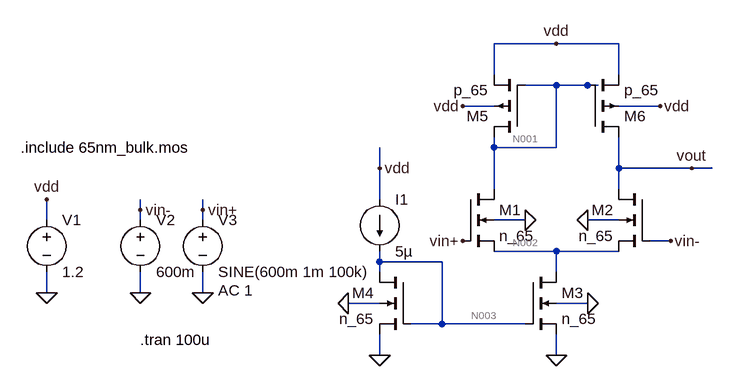
[diagram p0: schematic active_load_diff_amp.asc]
active_load_diff_amp.asc, the LTspice schematic file:
Version 4.1
SHEET 1 1004 680
WIRE 752 -32 656 -32
WIRE 848 -32 752 -32
WIRE 656 16 656 -32
WIRE 848 16 848 -32
WIRE 752 32 704 32
WIRE 800 32 752 32
WIRE 816 32 800 32
WIRE 656 64 608 64
WIRE 912 64 848 64
WIRE 656 128 656 112
WIRE 752 128 752 32
WIRE 752 128 656 128
WIRE 480 160 480 128
WIRE 848 160 848 112
WIRE 960 160 848 160
WIRE 992 160 960 160
WIRE 656 192 656 128
WIRE 848 192 848 160
WIRE 480 208 480 160
WIRE 112 224 112 208
WIRE 208 224 208 208
WIRE -32 240 -32 208
WIRE 112 240 112 224
WIRE 208 240 208 224
WIRE 704 240 656 240
WIRE 848 240 800 240
WIRE 928 272 896 272
WIRE 752 288 656 288
WIRE 848 288 752 288
WIRE 480 304 480 288
WIRE 576 304 480 304
WIRE 480 320 480 304
WIRE 752 320 752 288
WIRE -32 352 -32 320
WIRE 112 352 112 320
WIRE 208 352 208 320
WIRE 480 368 432 368
WIRE 800 368 752 368
WIRE 576 400 576 304
WIRE 576 400 528 400
WIRE 704 400 576 400
WIRE 480 448 480 416
WIRE 752 448 752 416
FLAG 704 240 0
FLAG 800 240 0
FLAG 800 368 0
FLAG 752 448 0
FLAG 432 368 0
FLAG 480 448 0
FLAG -32 352 0
FLAG -32 208 vdd
FLAG 480 160 vdd
FLAG 912 64 vdd
FLAG 608 64 vdd
FLAG 752 -32 vdd
FLAG 608 272 vin+
FLAG 960 160 vout
FLAG 112 352 0
FLAG 208 352 0
FLAG 112 224 vin-
FLAG 208 224 vin+
FLAG 928 272 vin-
SYMBOL nmos4 608 192 R0
SYMATTR InstName M1
SYMATTR Value n_65
SYMATTR Value2 l=200n w=20u
SYMBOL nmos4 896 192 M0
SYMATTR InstName M2
SYMATTR Value n_65
SYMATTR Value2 l=200n w=20u
SYMBOL nmos4 704 320 R0
SYMATTR InstName M3
SYMATTR Value n_65
SYMATTR Value2 l=500n w=30u
SYMBOL nmos4 528 320 M0
SYMATTR InstName M4
SYMATTR Value n_65
SYMATTR Value2 l=500n w=30u
SYMBOL current 480 208 R0
WINDOW 123 0 0 Left 0
WINDOW 39 0 0 Left 0
SYMATTR InstName I1
SYMATTR Value 5µ
SYMBOL voltage -32 224 R0
WINDOW 123 0 0 Left 0
WINDOW 39 0 0 Left 0
SYMATTR InstName V1
SYMATTR Value 1.2
SYMBOL pmos4 704 112 R180
SYMATTR InstName M5
SYMATTR Value p_65
SYMATTR Value2 l=300n w=10u
SYMBOL pmos4 800 112 M180
SYMATTR InstName M6
SYMATTR Value p_65
SYMATTR Value2 l=300n w=10u
SYMBOL voltage 112 224 R0
WINDOW 123 0 0 Left 0
WINDOW 39 0 0 Left 0
SYMATTR InstName V2
SYMATTR Value 600m
SYMBOL voltage 208 224 R0
WINDOW 123 24 124 Left 2
WINDOW 39 0 0 Left 0
SYMATTR Value2 AC 1
SYMATTR InstName V3
SYMATTR Value SINE(600m 1m 100k)
TEXT -72 128 Left 2 !.include 65nm_bulk.mos
TEXT 112 424 Left 2 !.tran 100u

The netlist it stands for:
* active_load_diff_amp.asc
M1 N001 vin+ N002 0 n_65 l=200n w=20u
M2 vout vin- N002 0 n_65 l=200n w=20u
M3 N002 N003 0 0 n_65 l=500n w=30u
M4 N003 N003 0 0 n_65 l=500n w=30u
I1 vdd N003 5µ
V1 vdd 0 1.2
M5 N001 N001 vdd vdd p_65 l=300n w=10u
M6 vout N001 vdd vdd p_65 l=300n w=10u
V2 vin- 0 600m
V3 vin+ 0 SINE(600m 1m 100k) AC 1
.model NMOS NMOS
.model PMOS PMOS
.lib standard.mos
.include 65nm_bulk.mos
.tran 100u
.backanno
.end

* Results of the author's LTspice run, read from the files saved beside the schematic
* Operating Point, zero values left out:
*   V(vin+) = 600 mV
*   V(vout) = 848.3 mV
*   V(vin-) = 600 mV
*   V(vdd) = 1.2 V
*   V(n001) = 848.3 mV
*   V(n002) = 297.8 mV
*   V(n003) = 296.1 mV
*   Id(M1) = 2.5 µA
*   Ig(M1) = 139.7 pA
*   Is(M1) = -2.5 µA
*   Ib(M1) = -1.16 pA
*   I(I1) = 5 µA
*   I(V1) = -9.999 µA
*   Id(M6) = -2.5 µA
*   Ig(M6) = -3.868 pA
*   Is(M6) = 2.5 µA
*   Id(M3) = 5 µA
*   Ig(M3) = 432.7 pA
*   Is(M3) = -5 µA
*   Id(M4) = 4.999 µA
*   Ig(M4) = 432.7 pA
*   Is(M4) = -5 µA
*   Id(M5) = -2.5 µA
*   Ig(M5) = -3.868 pA
*   Is(M5) = 2.5 µA
*   Id(M2) = 2.5 µA
*   Ig(M2) = 139.7 pA
*   Is(M2) = -2.5 µA
*   Ib(M2) = -1.16 pA
*   I(V2) = -139.7 pA
*   I(V3) = -139.7 pA
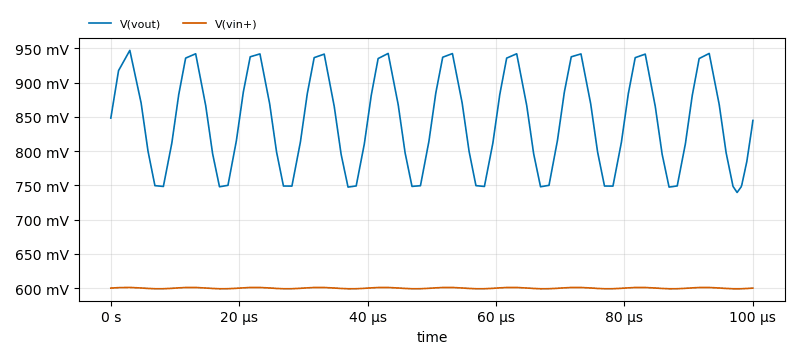
[diagram p1: Transient Analysis of active_load_diff_amp.asc, plotted from the saved traces]
* Transient Analysis, 1 run:
*   V(vout): min 739.6 mV, max 947.1 mV, average 846 mV, rms 849.2 mV, last 844.8 mV
*   V(vin+): min 599 mV, max 601 mV, average 600 mV, rms 600 mV, last 600 mV